# EAGLE design Nixie_driver.v1 (EAGLE 5.07)
LICENSE: CC-0; PROJECT: Nixie driver v1
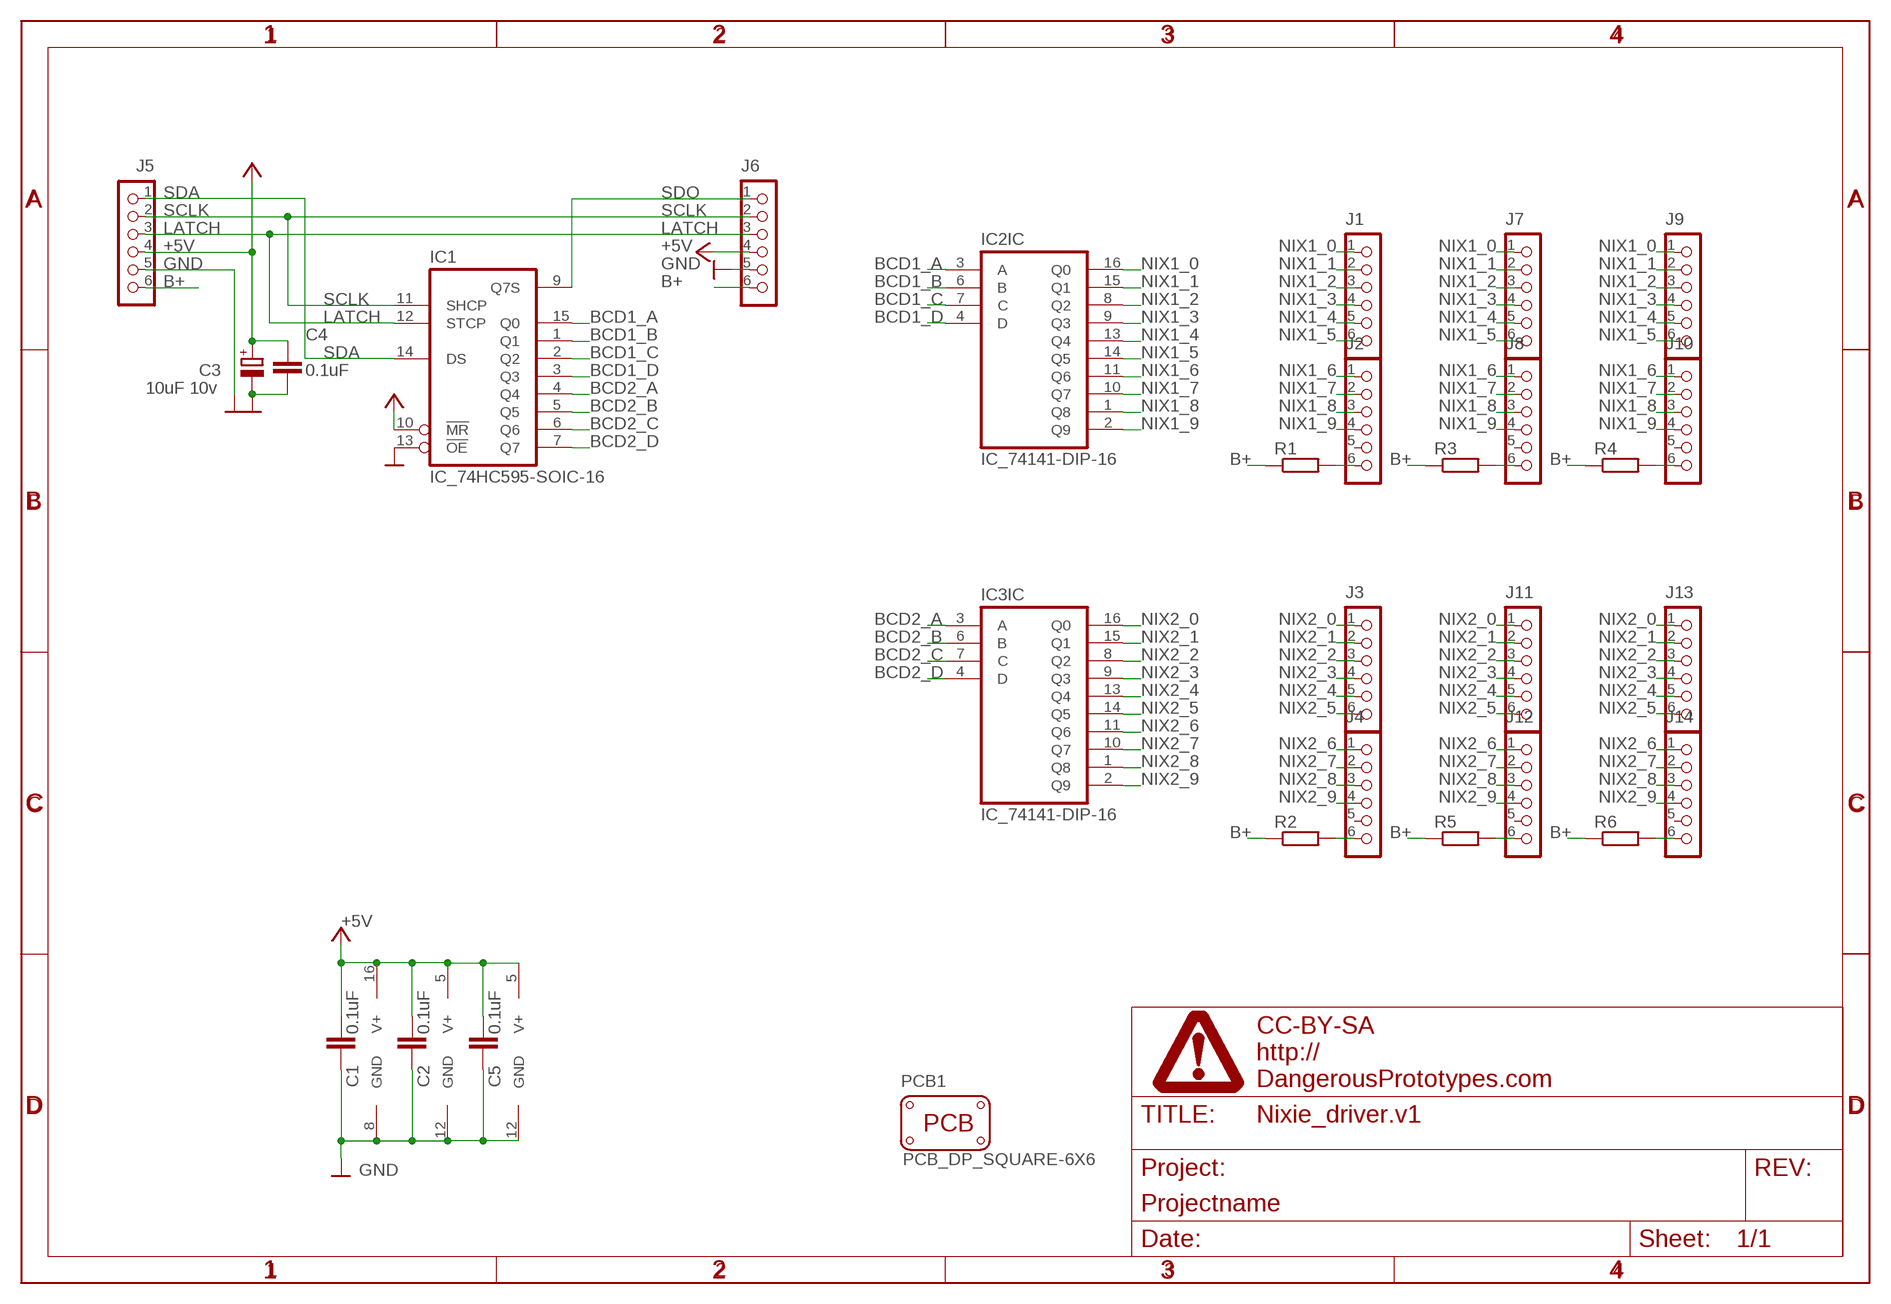
[diagram p0: schematic, sheet 1]

## Parts
C1  0.1uF  CAPACITOR_NPOL-0603  [C603]
C2  0.1uF  CAPACITOR_NPOL-0603  [C603]
C3  10uF 10v  CAPACITOR_POL-SMC_A  [SMC_A]
C4  0.1uF  CAPACITOR_NPOL-0603  [C603]
C5  0.1uF  CAPACITOR_NPOL-0603  [C603]
IC1  IC_74HC595-SOIC-16  [SOIC-16]
IC2  IC_74141-DIP-16  [DIL16]
IC3  IC_74141-DIP-16  [DIL16]
J1  CON_HEADER_1X06-PTH  [M1X6]
J2  CON_HEADER_1X06-PTH  [M1X6]
J3  CON_HEADER_1X06-PTH  [M1X6]
J4  CON_HEADER_1X06-PTH  [M1X6]
J5  CON_HEADER_1X06-PTH  [M1X6]
J6  CON_HEADER_1X06-PTH  [M1X6]
J7  CON_HEADER_1X06-PTH  [M1X6]
J8  CON_HEADER_1X06-PTH  [M1X6]
J9  CON_HEADER_1X06-PTH  [M1X6]
J10  CON_HEADER_1X06-PTH  [M1X6]
J11  CON_HEADER_1X06-PTH  [M1X6]
J12  CON_HEADER_1X06-PTH  [M1X6]
J13  CON_HEADER_1X06-PTH  [M1X6]
J14  CON_HEADER_1X06-PTH  [M1X6]
PCB1  PCB_DP_SQUARE-6X6  [DP6060_V1]
R1  RESISTOR-PTH-0.4  [RTH025W]
R2  RESISTOR-PTH-0.4  [RTH025W]
R3  RESISTOR-PTH-0.4  [RTH025W]
R4  RESISTOR-PTH-0.4  [RTH025W]
R5  RESISTOR-PTH-0.4  [RTH025W]
R6  RESISTOR-PTH-0.4  [RTH025W]
U$1  FRAME_DINA4_L  [DP_LOGO]

## Nets
+5V: C1.1 C2.1 C3.+ C4.1 C5.1 IC1.10(!MR) IC1.16(V+) IC2.5(SUPPLY:V+) IC3.5(SUPPLY:V+) J5.4 J6.4 ; supply symbol labelled SUPPLY_+5V
B+: J5.6 J6.6 R1.1 R2.1 R3.1 R4.1 R5.1 R6.1
BCD1_A: IC1.15(Q0) IC2.3(IC:A)
BCD1_B: IC1.1(Q1) IC2.6(IC:B)
BCD1_C: IC1.2(Q2) IC2.7(IC:C)
BCD1_D: IC1.3(Q3) IC2.4(IC:D)
BCD2_A: IC1.4(Q4) IC3.3(IC:A)
BCD2_B: IC1.5(Q5) IC3.6(IC:B)
BCD2_C: IC1.6(Q6) IC3.7(IC:C)
BCD2_D: IC1.7(Q7) IC3.4(IC:D)
GND: C1.2 C2.2 C3.- C4.2 C5.2 IC1.8(GND) IC1.13(!OE) IC2.12(SUPPLY:GND) IC3.12(SUPPLY:GND) J5.5 J6.5 ; supply symbol labelled SUPPLY_GND
LATCH: IC1.12(STCP) J5.3 J6.3
N$1: J8.6 R3.2
N$2: J10.6 R4.2
N$3: J12.6 R5.2
N$4: J14.6 R6.2
N$10: J2.6 R1.2
N$11: J4.6 R2.2
NIX1_0: IC2.16(IC:Q0) J1.1 J7.1 J9.1
NIX1_1: IC2.15(IC:Q1) J1.2 J7.2 J9.2
NIX1_2: IC2.8(IC:Q2) J1.3 J7.3 J9.3
NIX1_3: IC2.9(IC:Q3) J1.4 J7.4 J9.4
NIX1_4: IC2.13(IC:Q4) J1.5 J7.5 J9.5
NIX1_5: IC2.14(IC:Q5) J1.6 J7.6 J9.6
NIX1_6: IC2.11(IC:Q6) J2.1 J8.1 J10.1
NIX1_7: IC2.10(IC:Q7) J2.2 J8.2 J10.2
NIX1_8: IC2.1(IC:Q8) J2.3 J8.3 J10.3
NIX1_9: IC2.2(IC:Q9) J2.4 J8.4 J10.4
NIX2_0: IC3.16(IC:Q0) J3.1 J11.1 J13.1
NIX2_1: IC3.15(IC:Q1) J3.2 J11.2 J13.2
NIX2_2: IC3.8(IC:Q2) J3.3 J11.3 J13.3
NIX2_3: IC3.9(IC:Q3) J3.4 J11.4 J13.4
NIX2_4: IC3.13(IC:Q4) J3.5 J11.5 J13.5
NIX2_5: IC3.14(IC:Q5) J3.6 J11.6 J13.6
NIX2_6: IC3.11(IC:Q6) J4.1 J12.1 J14.1
NIX2_7: IC3.10(IC:Q7) J4.2 J12.2 J14.2
NIX2_8: IC3.1(IC:Q8) J4.3 J12.3 J14.3
NIX2_9: IC3.2(IC:Q9) J4.4 J12.4 J14.4
SCLK: IC1.11(SHCP) J5.2 J6.2
SDA: IC1.14(DS) J5.1
SDO: IC1.9(Q7S) J6.1
Unconnected: J2.5 J4.5 J8.5 J10.5 J12.5 J14.5

## Library data of the parts
C1 C2 C4 C5 = dp_devices:CAPACITOR_NPOL: Non-Polarized capacitor in various packages
C3 = dp_devices:CAPACITOR_POL: Polarized capacitor in various packages
IC1 = dp_devices:IC_74HC595: 8-bit serial-in parallel out shift register, output latch 3-state
IC2 IC3 = dp_devices:IC_74141: BCD to decimal decoder
J1-J14 = dp_devices:CON_HEADER_1X06
PCB1 = dp_devices:PCB_DP_SQUARE: Dangerous Prototypes Standard Square PCB sizes
R1-R6 = dp_devices:RESISTOR
U$1 = dp_devices:FRAME_DINA4_L: A4 DP frame Standard Dangerous Prototypes schematic frame. Automagically adds the DP logo and standard texts to the PCB Use the atrribute in the schematic editor to change the fields.; FF1: fulfillment by; FF2: Seeed Studio; FF3: www.seeedstudio.com; LICENSE: CC-BY-SA; PROJECT: Projectname; URL1: http://; URL2: DangerousPrototypes.com

## Board
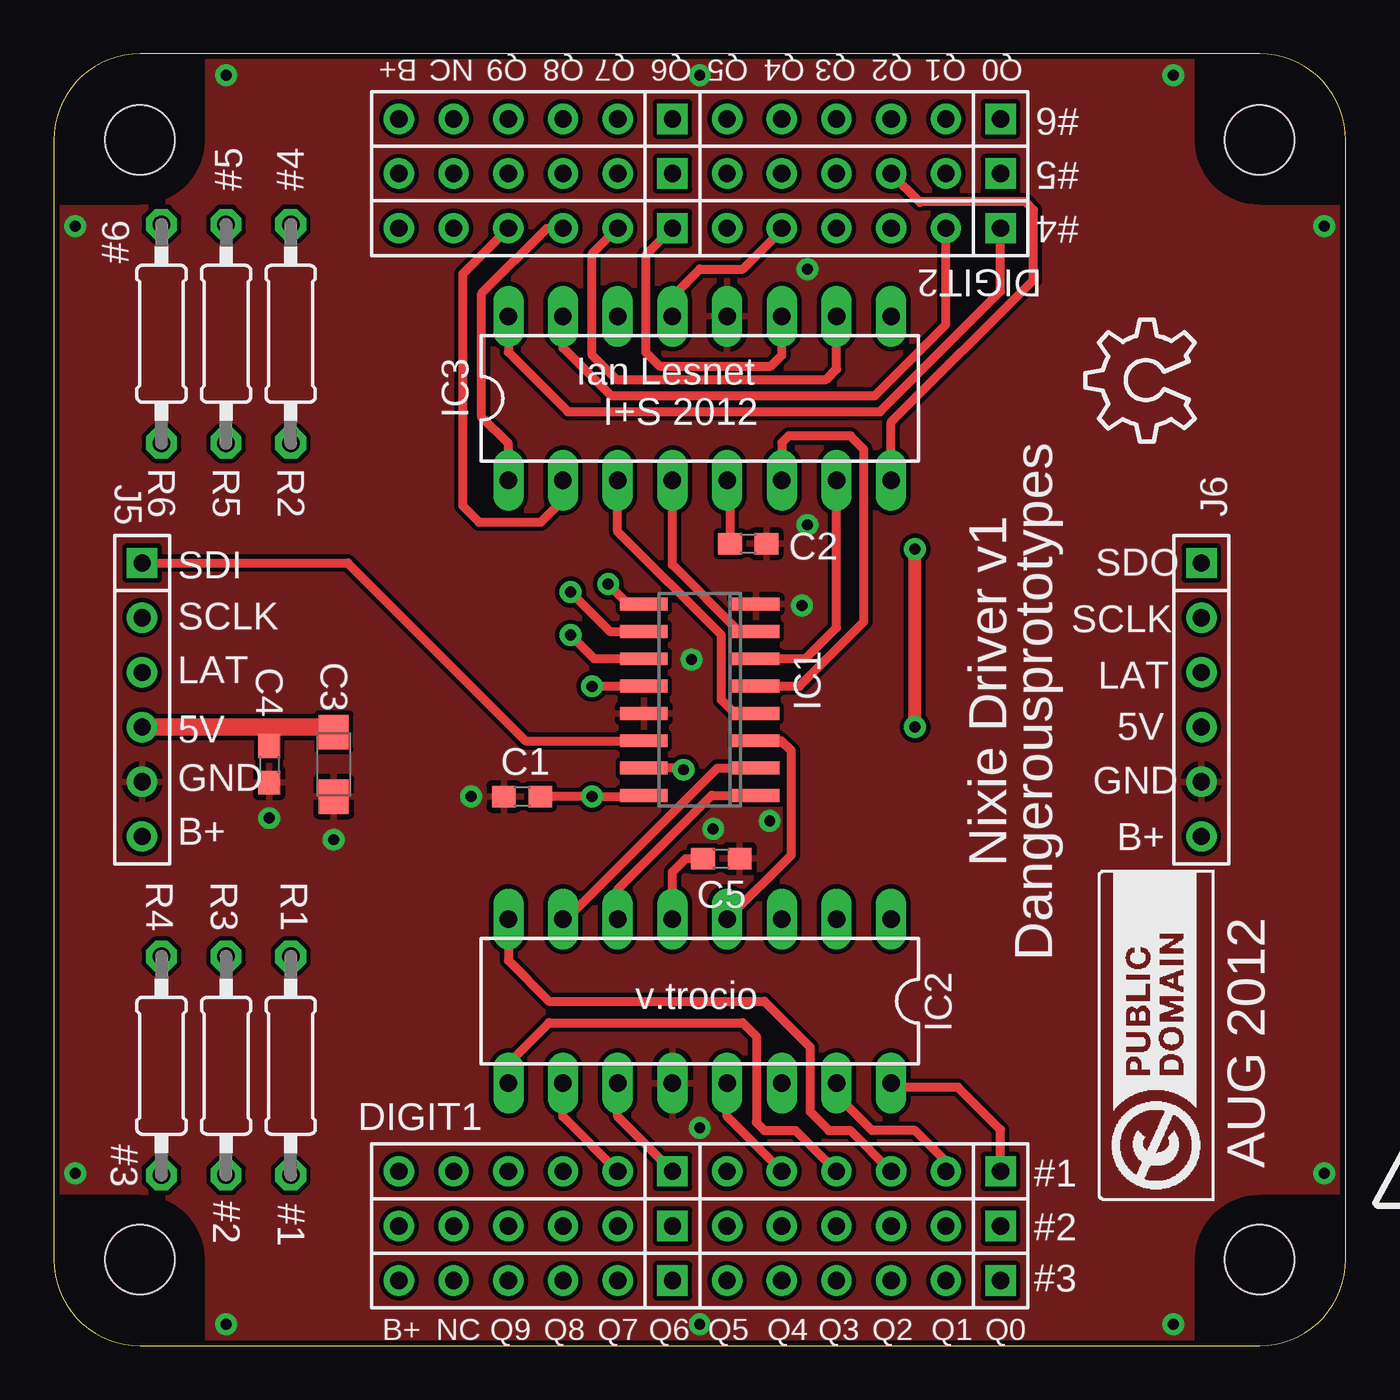
[diagram p1: board, top side]
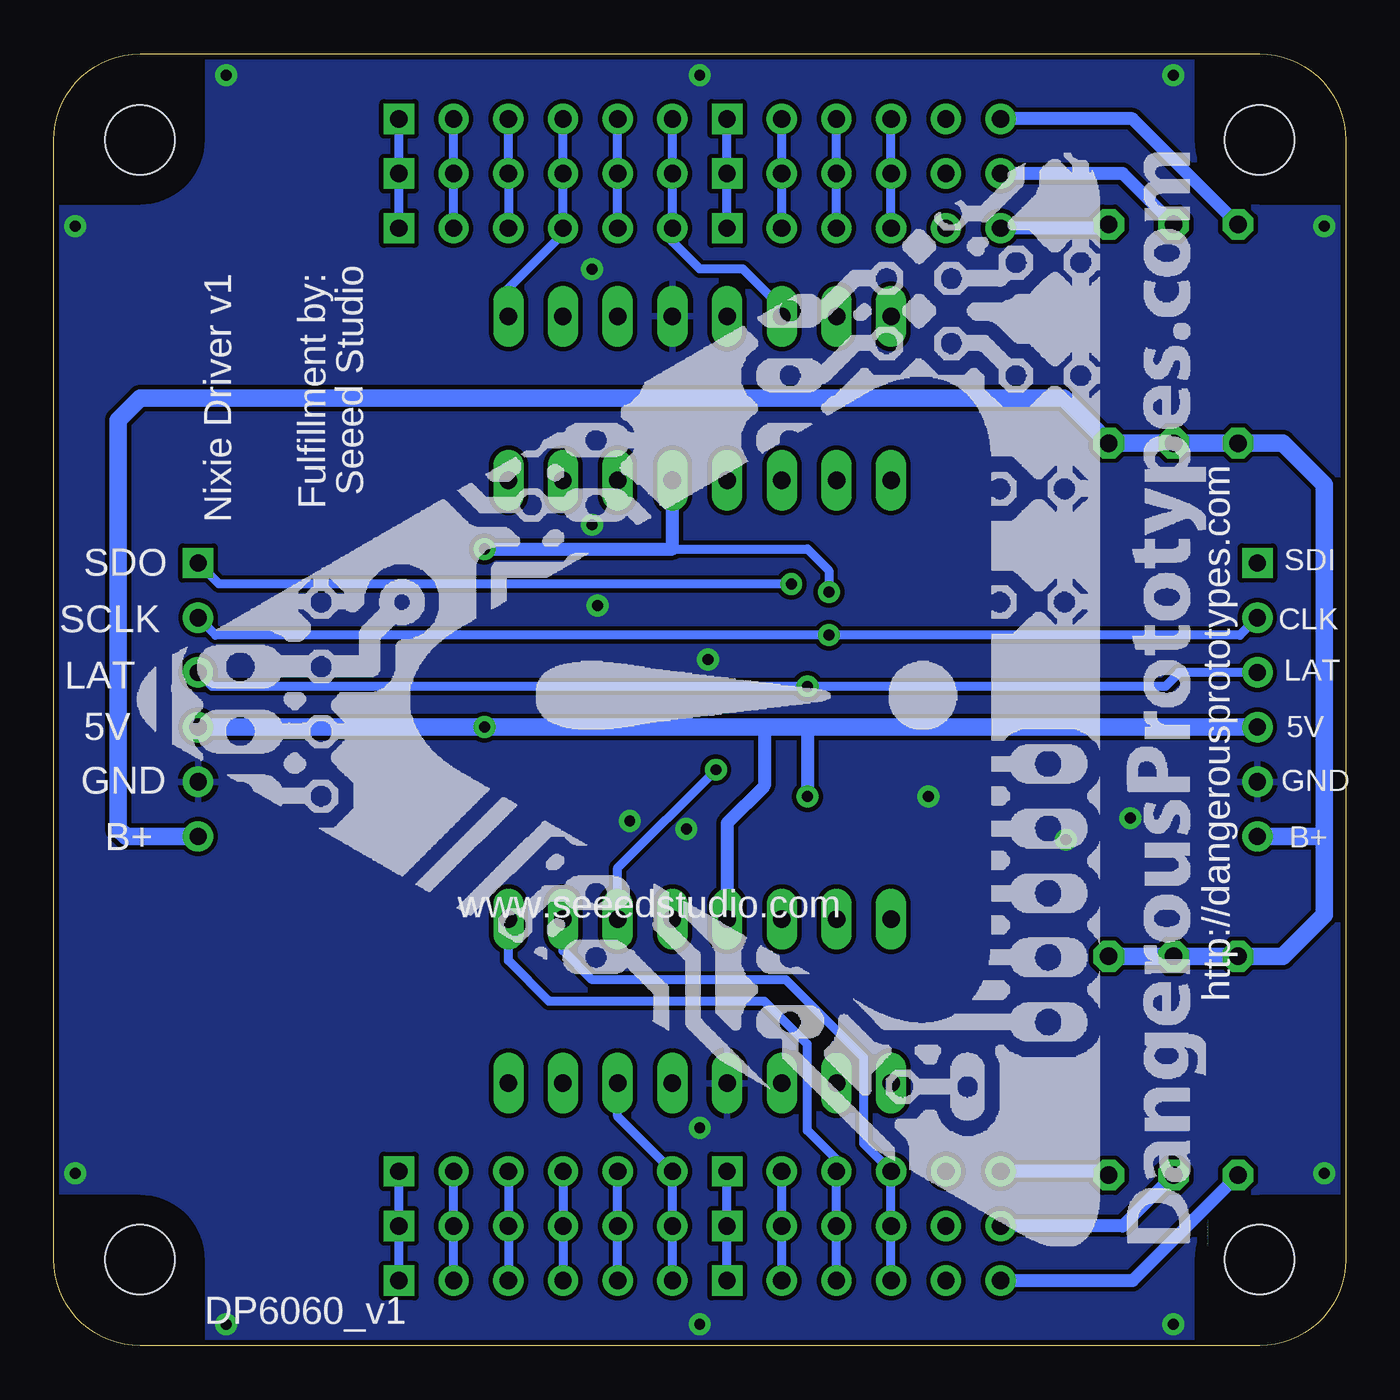
[diagram p2: board, bottom side, seen from below]

Size 60 x 60 mm. Coordinates in mm from the lower left corner, seen from the top.
Copper layers (1*16): Top 0.035mm / dielectric 1.5mm / Bottom 0.035mm
Design rules "SparkFun": minimum track width 8mil, minimum drill 20mil, track to track 8mil, track to pad 8mil, pad to pad 8mil, via to via 8mil, smd to smd 8mil, copper to edge 10mil, drill to drill 8mil, minimum pad ring 12mil, minimum via ring 10mil, stop-mask expansion 4mil, vias tented up to drill 25mil, thermal gap 10mil

### Footprints (pad centres in the part's own frame; a part is rotated, then mirrored left to right if it is on the bottom)
C603 = smd 1.1 x 1: 1 -0.85,0; 2 0.85,0
SMC_A = smd 1.6 x 1.4: + -1.5,0; - 1.5,0
SOIC-16 = smd 0.6 x 2.2: 1 -4.445,-2.6; 2 -3.175,-2.6; 3 -1.905,-2.6; 4 -0.635,-2.6; 5 0.635,-2.6; 6 1.905,-2.6; 7 3.175,-2.6; 8 4.445,-2.6; 9 4.445,2.6; 10 3.175,2.6; 11 1.905,2.6; 12 0.635,2.6; 13 -0.635,2.6; 14 -1.905,2.6; 15 -3.175,2.6; 16 -4.445,2.6
DIL16 = drill 0.813 long: 1 -8.89,-3.81; 2 -6.35,-3.81; 3 -3.81,-3.81; 4 -1.27,-3.81; 5 1.27,-3.81; 6 3.81,-3.81; 7 6.35,-3.81; 8 8.89,-3.81; 9 8.89,3.81; 10 6.35,3.81; 11 3.81,3.81; 12 1.27,3.81; 13 -1.27,3.81; 14 -3.81,3.81; 15 -6.35,3.81; 16 -8.89,3.81
M1X6 = drill 0.8 square: 1 0,0 | drill 0.8 round: 2 2.54,0; 3 5.08,0; 4 7.62,0; 5 10.16,0; 6 12.7,0
DP6060_V1 = hole 3.2: 4,4; 56,4; 56,56; 4,56
RTH025W = drill 0.813 octagon: 1 -5.08,0; 2 5.08,0

### Placement (x,y rotation side)
C1  21.75,25.5 180 top
C2  32.25,37.25 0 top
C3  13,27 270 top
C4  10,27 270 top
C5  31,22.62 0 top
IC1  30,30 90 top
IC2  30,16 180 top
IC3  30,44 0 top
J1  43.97,8.1 180 top
J2  28.73,8.1 180 top
J3  43.97,51.9 180 top
J4  28.73,51.9 180 top
J5  4.1,36.35 270 top
J6  53.3,36.35 270 top
J7  43.97,5.56 180 top
J8  28.73,5.56 180 top
J9  43.97,3.02 180 top
J10  28.73,3.02 180 top
J11  43.97,54.44 180 top
J12  28.73,54.44 180 top
J13  43.97,56.98 180 top
J14  28.73,56.98 180 top
PCB1  0,0 0 top
R1  11,13 270 top
R2  11,47 90 top
R3  8,13 270 top
R4  5,13 270 top
R5  8,47 90 top
R6  5,47 90 top
U$1  63,7 0 top
U$2  [OSHW_8X200_NOTEXT]  53,42 90 top
U$3  [LOGO_CC-0]  53.88,6.75 90 top
U$4  [DP_LOGO_ART_2X2]  6.5,4.62 90 bottom

### Tracks (layer width: path | path; a pad name or v marks a point on that pad's centre or on a via)
+5V  (via drill 0.51)
  Top 0.406: C3.+ 12.87,28.63 | 10,28.63 C4.1 | IC1.16 27.4,25.52 27.38,25.5 v25,25.5 C1.1 | C5.1 29.36,22.62 28.73,22 IC2.5 | C2.1 31.4,40.06 IC3.5 | IC1.10 25.82,33.17 v24,35
  Top 0.61: v40,28.73 v40,37
  Top 0.813: J5.4 10,28.73 | 10,28.73 12.77,28.73 C3.+ | 10,28.73 10,28.63
  Bottom 0.406: 25.12,28.73 25,28.61 | v24,35 24,36 25,37 31.25,37
  Bottom 0.61: IC2.5 28.73,24.27 27,26 27,28.73 | 25,28.61 v25,25.5 | 31.27,37 31.25,37 | 31.27,37 IC3.5 | v40,37 31.27,37
  Bottom 0.813: J5.4 25.12,28.73 27,28.73 v40,28.73 J6.4
B+
  Bottom 0.813: 1,23.5 1,20 2.92,18.08 R4.1 R3.1 R1.1 | 1,23.5 1,40 2.92,41.92 R6.1 R5.1 R2.1 13.08,44 56,44 57,43 57,24 56.65,23.65 J6.6 | 1,23.5 1.15,23.65 J5.6
BCD1_A  (via drill 0.51)
  Top 0.406: IC1.15 29.18,26.82 v29.25,26.75
  Bottom 0.406: IC2.3 33.81,22.19 v29.25,26.75
BCD1_B
  Top 0.406: IC1.1 30.55,25.55 26.19,21.19 IC2.6
BCD1_C
  Top 0.406: IC1.2 30.82,26.82 23.81,19.81 IC2.7
BCD1_D
  Top 0.406: IC1.3 33.78,28.09 34.25,27.62 34.25,22.79 IC2.4
BCD2_A
  Top 0.406: IC3.3 26.19,37.81 31,33 31,30 31.64,29.36 IC1.4
BCD2_B
  Top 0.406: IC1.5 34.63,30.64 37.62,33.62 37.62,41.62 37,42.25 34.12,42.25 33.81,41.94 IC3.6
BCD2_C
  Top 0.406: IC1.6 34.91,31.91 36.35,33.35 IC3.7
BCD2_D
  Top 0.406: IC3.4 28.73,36.27 31.82,33.17 IC1.7
GND  (via drill 0.51)
  other vias: 13,23.5 10,24.5 19.38,25.5 30.62,24 29.62,31.88 35,38.12 30,10.12 8,59 1,52 52,59 59,52 52,1 59,8 8,1 1,8 30,1 30,59 35,50 33.25,24.38 34.75,34.38
  pour Bottom (rank 6): 0,60 60,60 60,0 0,0
  pour Top (rank 6): 0,60 60,60 60,0 0,0
LATCH  (via drill 0.51)
  Top 0.406: IC1.12 25.01,30.64 v25,30.62
  Bottom 0.406: J5.3 7.73,31.27 8.38,30.62 v25,30.62 52.66,30.62 J6.3
N$1
  Bottom 0.61: J8.6 10.36,5.56 R3.2
N$2
  Bottom 0.61: J10.6 9.9,3.02 R4.2
N$3
  Bottom 0.61: J12.6 10.36,54.44 R5.2
N$4
  Bottom 0.61: J14.6 9.9,56.98 R6.2
N$10
  Bottom 0.61: J2.6 11.18,8.1 R1.2
N$11
  Bottom 0.61: J4.6 11.18,51.9 R2.2
NIX1_0
  Top 0.406: J1.1 43.97,10.03 42,12 39.08,12 IC2.16
  Bottom 0.406: J9.1 J7.1 J1.1
NIX1_1
  Top 0.406: J1.2 41.43,8.57 40,10 38,10 36.35,11.65 IC2.15
  Bottom 0.406: J9.2 J7.2 J1.2
NIX1_2
  Top 0.406: IC2.8 21.11,17.89 23,16 33,16 35.12,13.88 35.12,10.88 36,10 36.99,10 J1.3
  Bottom 0.406: J9.3 J7.3 J1.3
NIX1_3
  Top 0.406: IC2.9 21.11,13.11 23,15 32,15 32.62,14.38 32.62,10.38 33,10 34.45,10 J1.4
  Bottom 0.406: J9.4 J7.4 J1.4
NIX1_4
  Top 0.406: IC2.13 31.27,10.64 J1.5
  Bottom 0.406: J9.5 J7.5 J1.5
NIX1_5
  Bottom 0.406: J9.6 J7.6 J1.6 33.81,10.64 IC2.14
NIX1_6
  Top 0.406: IC2.11 26.19,10.64 J2.1
  Bottom 0.406: J10.1 J8.1 J2.1
NIX1_7
  Top 0.406: IC2.10 23.65,10.64 J2.2
  Bottom 0.406: J10.2 J8.2 J2.2
NIX1_8
  Bottom 0.406: J10.3 J8.3 J2.3 23.65,8.65 25,10 25,14 27,16 37,16 38.89,17.89 IC2.1
NIX1_9
  Bottom 0.406: J10.4 J8.4 J2.4 22.38,9.38 22.38,13.38 26,17 35,17 36.35,18.35 IC2.2
NIX2_0
  Top 0.406: J3.1 43.97,48.97 38.38,43.38 23.88,43.38 21.11,46.14 IC3.16
  Bottom 0.406: J13.1 J11.1 J3.1
NIX2_1
  Top 0.406: J3.2 41.43,47.43 38.12,44.12 25.88,44.12 23.65,46.35 IC3.15
  Bottom 0.406: J13.2 J11.2 J3.2
NIX2_2
  Top 0.406: IC3.8 38.89,42.89 45.5,49.5 45.5,52.75 45.12,53.12 40.25,53.12 40.23,53.1 J11.3
  Bottom 0.406: J13.3 J11.3 J3.3
NIX2_3
  Bottom 0.406: J13.4 J11.4 J3.4 36.35,51.65 38.89,49.11 IC3.9
NIX2_4
  Top 0.406: IC3.13 28.73,48.73 30,50 32,50 33.81,51.81 J3.5
  Bottom 0.406: J13.5 J11.5 J3.5
NIX2_5
  Bottom 0.406: J13.6 J11.6 J3.6 31.27,51.27 30,50 28,50 26.19,48.19 IC3.14
NIX2_6
  Top 0.406: IC3.11 33.81,46 33.31,45.5 28.12,45.5 27.5,46.12 27.5,50.67 J4.1
  Bottom 0.406: J14.1 J12.1 J4.1
NIX2_7
  Top 0.406: IC3.10 36.35,45.35 35.88,44.88 26.12,44.88 25,46 25,50.71 J4.2
  Bottom 0.406: J14.2 J12.2 J4.2
NIX2_8
  Top 0.406: IC3.1 21.11,41.89 19.88,43.12 19.88,48.88 22.9,51.9 J4.3
  Bottom 0.406: J14.3 J12.3 J4.3
NIX2_9
  Top 0.406: 23.65,39.65 IC3.2 23.65,39.27 22.62,38.25 19.75,38.25 19,39 19,49.79 J4.4
  Bottom 0.406: J14.4 J12.4 J4.4
SCLK  (via drill 0.51)
  Top 0.406: IC1.11 25.09,31.91 v24,33
  Bottom 0.406: J5.2 4.91,33 v24,33 52.49,33 J6.2
SDA
  Top 0.406: IC1.14 21.91,28.09 13.65,36.35 J5.1
SDO  (via drill 0.51)
  Top 0.406: IC1.9 26.68,34.45 v25.75,35.38
  Bottom 0.406: v25.75,35.38 52.33,35.38 J6.1

### Text on the board
tPlace: B+ | NC | Q9 | Q8 | Q7 | Q6 | Q5 | Q4 | Q3 | Q2 | Q1 | Q0 | #6 | #5 | #5 | #4 | #4 | #6 | DIGIT2 | Ian Lesnet | I+S 2012 | SDI | SDO | SCLK | SCLK | LAT | LAT | 5V | 5V | GND | GND | B+ | B+ | Nixie Driver v1 | Dangerousprototypes | v.trocio | DIGIT1 | #3 | AUG 2012 | #2 | #1 | #1 | #2 | #3 | B+ | NC | Q9 | Q8 | Q7 | Q6 | Q5 | Q4 | Q3 | Q2 | Q1 | Q0
bPlace: Seeed Studio | Fulfillment by: | Nixie Driver v1 | SDI | SDO | CLK | SCLK | LAT | LAT | 5V | 5V | GND | GND | B+ | B+ | www.seeedstudio.com | http://dangerousprototypes.com